# Altium schematic sheet othershecmatic.SchDoc
size A3
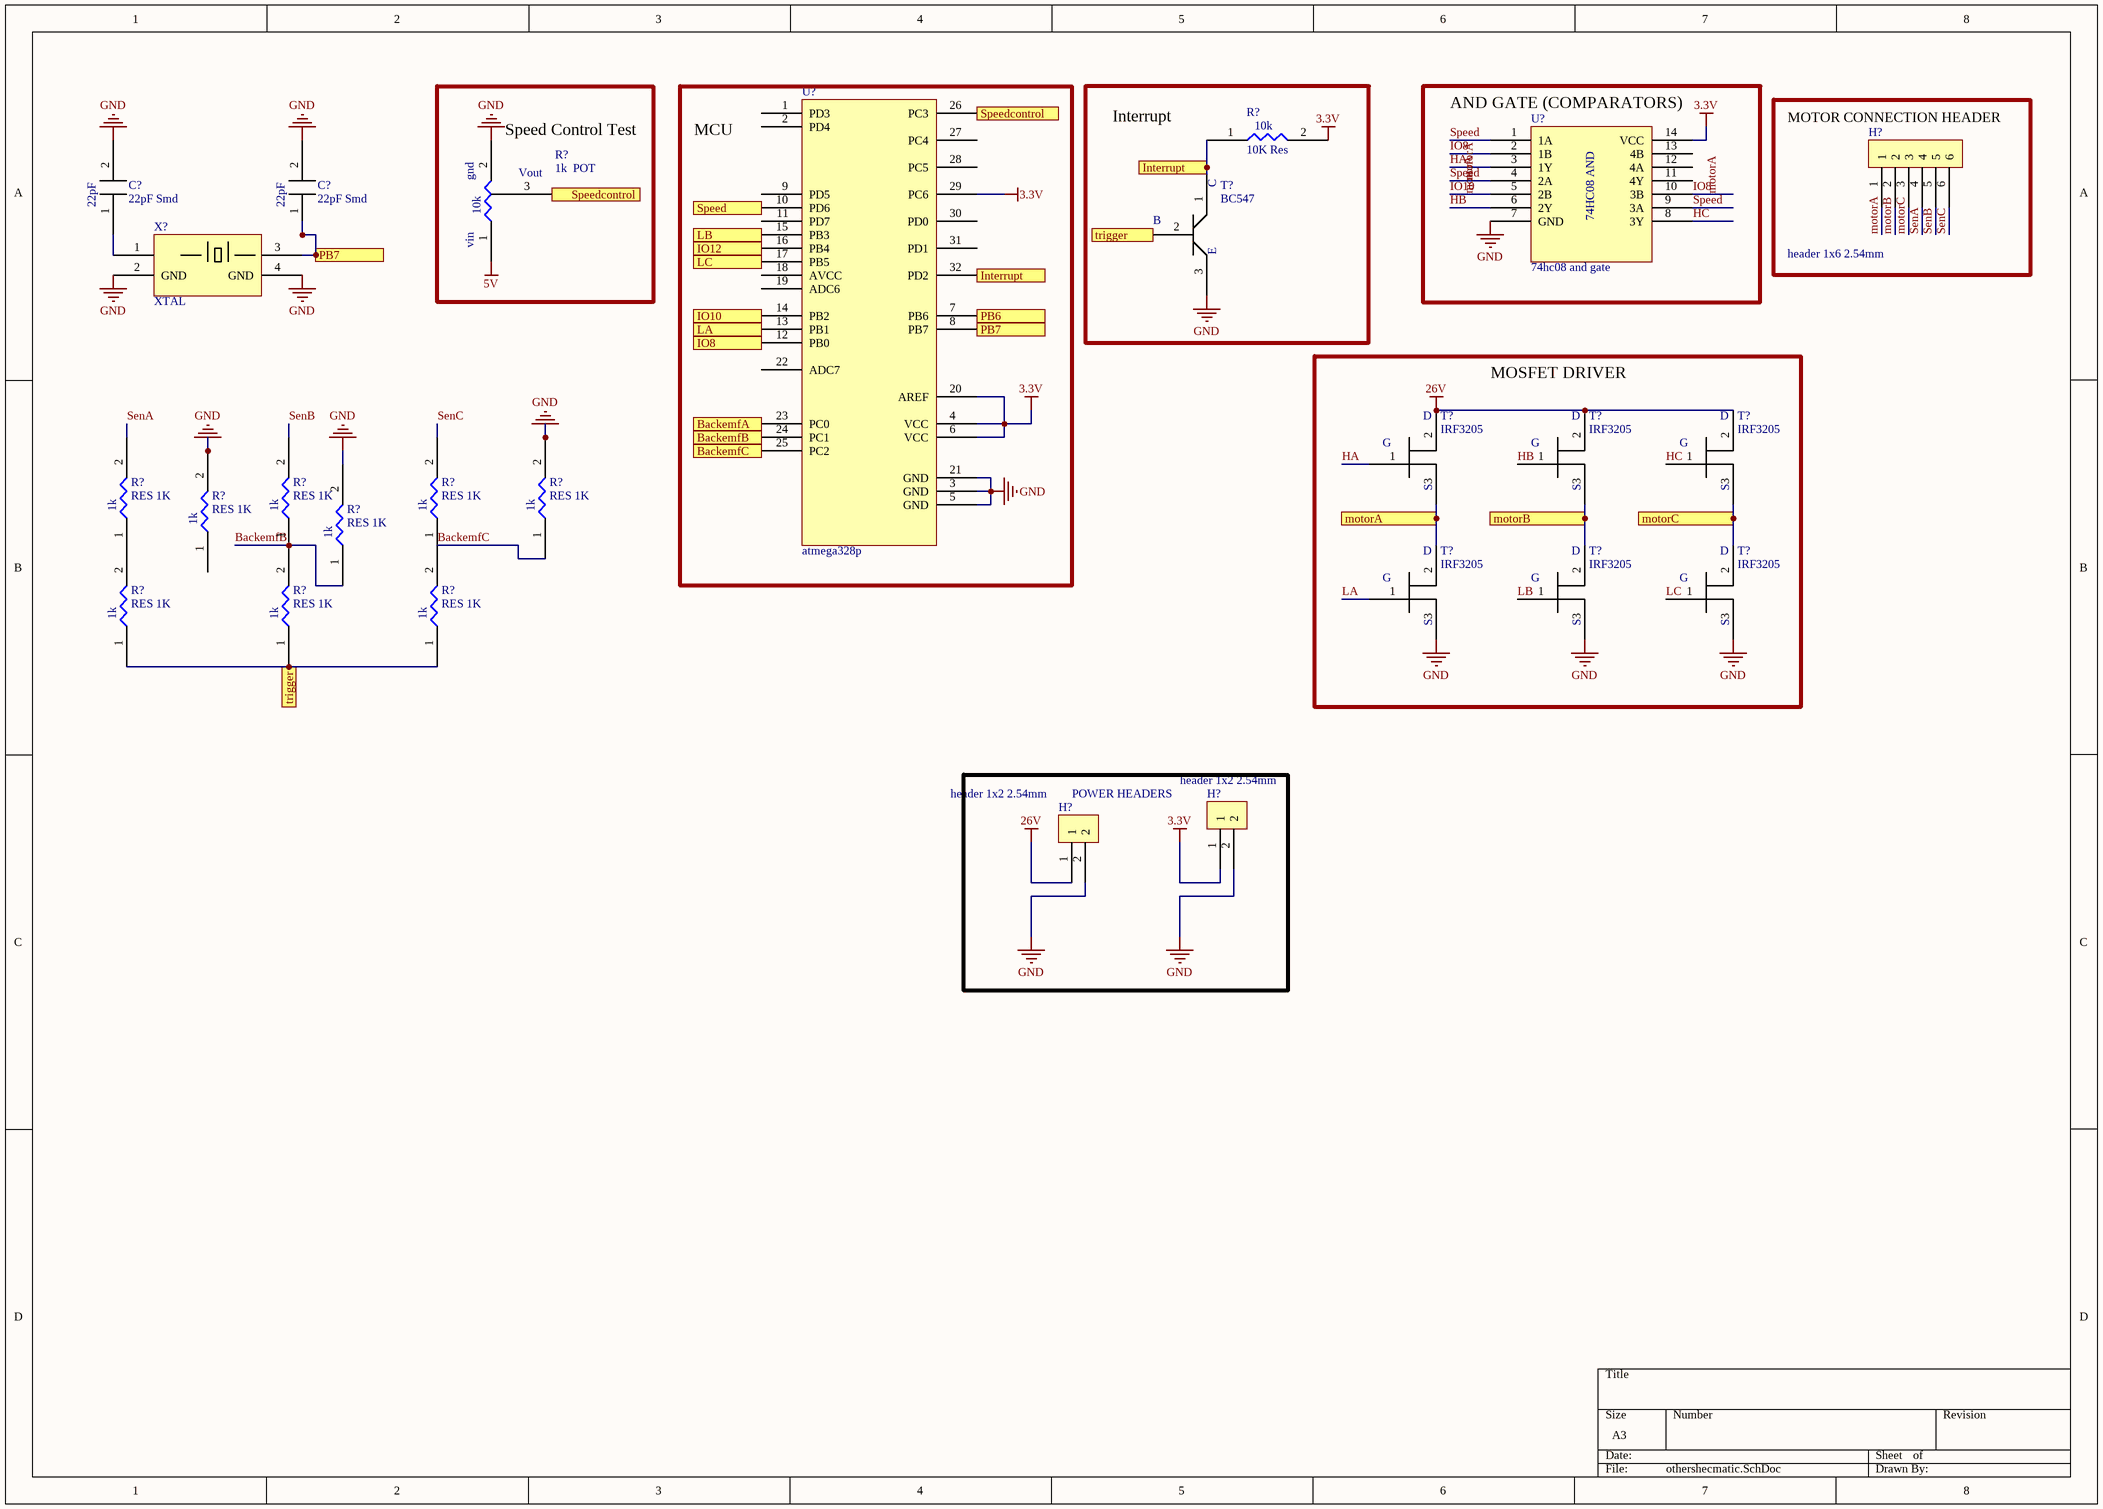
[diagram p0: othershecmatic.SchDoc]

## Parts
(Parts that share a designator on the sheet are numbered #1, #2 ... from top to bottom, then left to right.)
C?#1  22pF Smd  [smd cap]
C?#2  22pF Smd  [smd cap]
H?#1  header 1x6 2.54mm  [Header 1x6 2.54mm]
H?#2  header 1x2 2.54mm  [HEADER 1X2 2.54mm]
H?#3  header 1x2 2.54mm  [HEADER 1X2 2.54mm]
R?#1  10K Res  [smd res]
R?#2  1k  POT  [smd trimpot]
R?#3  RES 1K  [smd res]
R?#4  RES 1K  [smd res]
R?#5  RES 1K  [smd res]
R?#6  RES 1K  [smd res]
R?#7  RES 1K  [smd res]
R?#8  RES 1K  [smd res]
R?#9  RES 1K  [smd res]
R?#10  RES 1K  [smd res]
R?#11  RES 1K  [smd res]
T?#1  BC547  [TO-92]
T?#2  IRF3205  [smd mosfet]
T?#3  IRF3205  [smd mosfet]
T?#4  IRF3205  [smd mosfet]
T?#5  IRF3205  [smd mosfet]
T?#6  IRF3205  [smd mosfet]
T?#7  IRF3205  [smd mosfet]
U?#1  74hc08 and gate  [SOIC127P1030X265-14N]
U?#2  atmega328p  [atmega238p]
X?  XTAL  [xtal]

## Ports
BackemfA, BackemfB, BackemfC, Interrupt, IO8, IO10, IO12, LA, LB, LC, motorA, motorB, motorC, PB6, PB7, Speed, Speedcontrol, trigger

## Nets
3.3V: H?#2.1 R?#1.2 U?#1.14(VCC) U?#2.4(VCC) U?#2.6(VCC) U?#2.20(AREF) U?#2.29(PC6)
5V: R?#2.1
26V: H?#3.1 T?#2.2 T?#3.2 T?#4.2
GND: C?#1.2 C?#2.2 H?#2.2 H?#3.2 R?#2.2(GND) R?#6.2 R?#7.2 R?#8.2 T?#1.3 T?#5.3 T?#6.3 T?#7.3 U?#1.7(GND) U?#2.3(GND) U?#2.5(GND) U?#2.21(GND) X?.2(GND) X?.4(GND)
BackemfA: U?#2.23(PC0) ; port BackemfA
BackemfB: U?#2.24(PC1) ; port BackemfB
BackemfB: R?#8.1 R?#10.2  [a separate net that carries the same name]
BackemfC: U?#2.25(PC2) ; port BackemfC
BackemfC: R?#6.1 R?#11.2  [a separate net that carries the same name]
HA: T?#2.1 U?#1.3(1Y)
HB: T?#3.1 U?#1.6(2Y)
HC: T?#4.1 U?#1.8(3Y)
Interrupt: R?#1.1 T?#1.1 U?#2.32(PD2) ; port Interrupt
IO8: U?#2.12(PB0) ; port IO8
IO10: U?#2.14(PB2) ; port IO10
IO10: H?#1.1 U?#1.1(1A) U?#1.2(1B) U?#1.4(2A) U?#1.5(2B) U?#1.9(3A) U?#1.10(3B)  [also labelled IO8, motorA, Speed]  [a separate net that carries the same name]
IO12: U?#2.16(PB4) ; port IO12
LA: U?#2.13(PB1) ; port LA
LA: T?#5.1  [a separate net that carries the same name]
LB: U?#2.15(PB3) ; port LB
LB: T?#6.1  [a separate net that carries the same name]
LC: U?#2.17(PB5) ; port LC
LC: T?#7.1  [a separate net that carries the same name]
motorA: T?#2.3 T?#5.2 ; port motorA
motorB: T?#3.3 T?#6.2 ; port motorB
motorB: H?#1.2  [a separate net that carries the same name]
motorC: T?#4.3 T?#7.2 ; port motorC
motorC: H?#1.3  [a separate net that carries the same name]
PB6: U?#2.7(PB6) ; port PB6
PB7: C?#2.1 U?#2.8(PB7) X?.3 ; port PB7
SenA: H?#1.4 R?#3.2
SenB: H?#1.5 R?#4.2
SenC: H?#1.6 R?#5.2
Speed: U?#2.10(PD6) ; port Speed
Speedcontrol: R?#2.3 U?#2.26(PC3) ; port Speedcontrol
trigger: R?#9.1 R?#10.1 R?#11.1 T?#1.2 ; port trigger
NetC?#1_1: C?#1.1 X?.1

Not connected (* = marked no-connect by the designer): R?#3 1; R?#4 1; R?#5 1; R?#7 1; R?#9 2; U?#1 11(4Y) 12(4A) 13(4B); U?#2 1(PD3) 2(PD4) 9(PD5) 11(PD7) 18(AVCC) 19(ADC6) 22(ADC7) 27(PC4) 28(PC5) 30(PD0) 31(PD1)

## Notes on the sheet
- (near U?#1) AND GATE (COMPARATORS)
- (near R?#2) Speed Control Test
- MCU
- Interrupt
- (near H?#1) MOTOR CONNECTION HEADER
- MOSFET DRIVER
- (near H?#3) POWER HEADERS
- (in symbol 1k  POT) gnd; Vout; 10k; vin
- (in symbol 10K Res) 10k
- (in symbol 22pF Smd) 22pF
- (in symbol 74hc08 and gate) 74HC08 AND
- (in symbol BC547) C; B; E
- (in symbol IRF3205) D; G; S
- (in symbol RES 1K) 1k

## Library data of the parts
R?#1 = 10K Res: 10K SMD Res
R?#3-R?#11 = RES 1K: 1K Res
X? = XTAL: 16MHz Xtal